# Altium schematic sheet Fuente.SchDoc
size A4
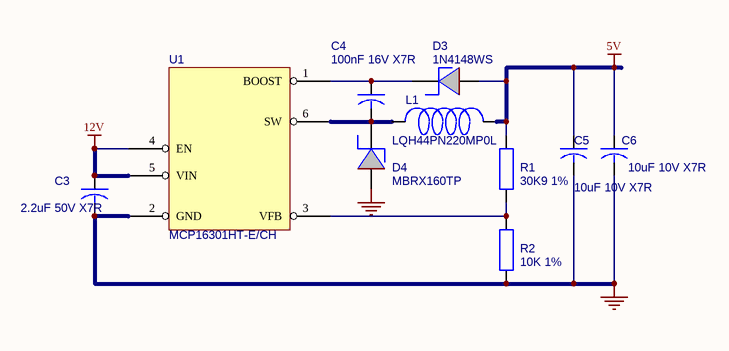
[diagram p0: Fuente.SchDoc]

## Parts
C3  2.2uF 50V X7R  [C_0805]
C4  100nF 16V X7R  [C_0805]
C5  10uF 10V X7R  [C_0805]
C6  10uF 10V X7R  [C_0805]
D3  1N4148WS  [SOD_323]
D4  MBRX160TP  [SOD_123]
L1  LQH44PN220MP0L  [VLCF5028]
R1  30K9 1%  [R_0805]
R2  10K 1%  [R_0805]
U1  MCP16301HT-E/CH  [SOT23_6P]

## Nets
5V: C5.1 C6.1 D3.1(A) L1.2 R1.2
12V: C3.1 U1.4(EN) U1.5(VIN)
GND: C3.2 C5.2 C6.2 D4.1(A) R2.1 U1.2(GND)
NetC4_1: C4.1 D3.2(K) U1.1(BOOST)
NetC4_2: C4.2 D4.2(K) L1.1 U1.6(SW)
NetR1_1: R1.1 R2.2 U1.3(VFB)

## Library data of the parts
C3-C6 = CAP: Capacitor
D3 = DIODO_SH: Diode Shottky
D4 = DIODO_SH: Diode schottky
L1 = Inductor
R1 R2 = RES: Resistor
U1 = MCP16301: Buck 36V-adj 600mA SOT-6